# Altium schematic sheet EMMC with rk399.SchDoc
size A4; SheetNumber: 14; SheetTotal: 26
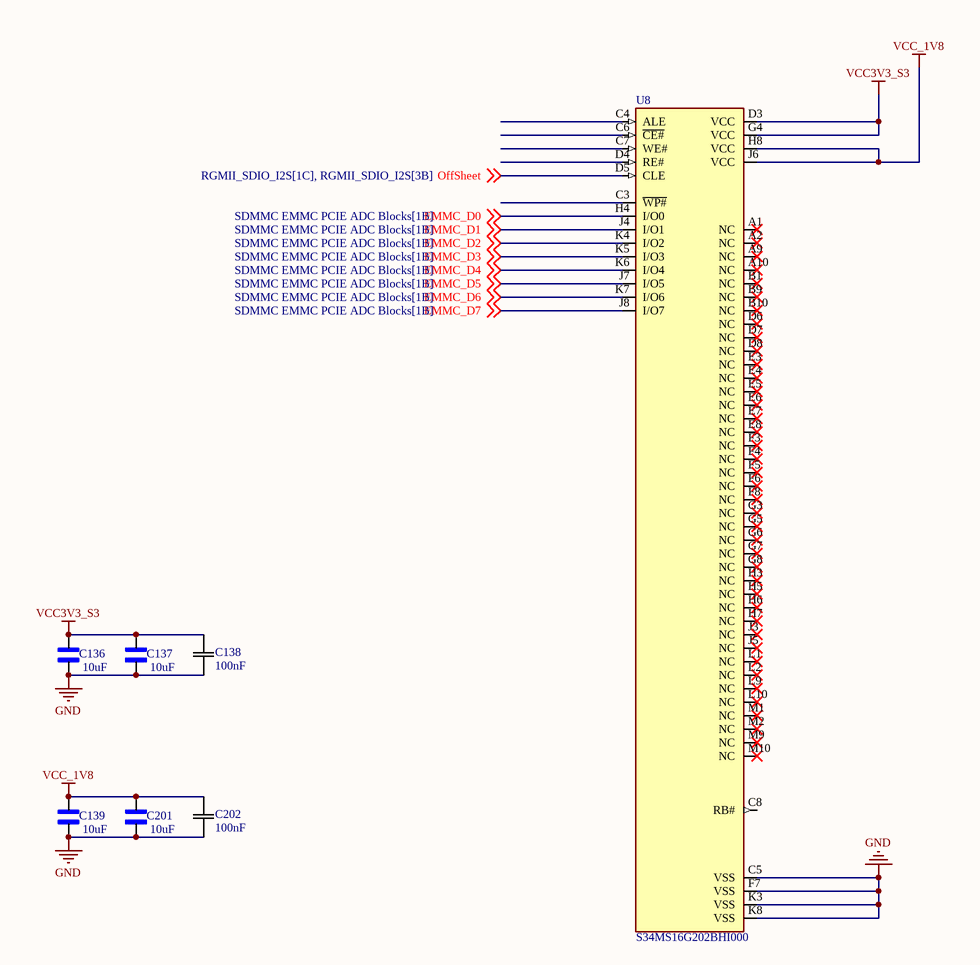
[diagram p0: EMMC with rk399.SchDoc]

## Parts
C136  10uF  [CAPC1005X70N]
C137  10uF  [CAPC1005X70N]
C138  100nF  [CAP_1005_TDK]
C139  10uF  [CAPC1005X70N]
C201  10uF  [CAPC1005X70N]
C202  100nF  [CAP_1005_TDK]
U8  S34MS16G202BHI000  [BGA63C80P12X10_1100X900X120]

## Nets
GND: C136.1 C137.1 C138.2 C139.1 C201.1 C202.2 U8.C5(VSS) U8.F7(VSS) U8.K3(VSS) U8.K8(VSS)
VCC3V3_S3: C136.2 C137.2 C138.1 U8.D3(VCC) U8.G4(VCC)
VCC_1V8: C139.2 C201.2 C202.1 U8.H8(VCC) U8.J6(VCC)
EMMC_D0: U8.H4(I/O0) ; off-sheet EMMC_D0
EMMC_D1: U8.J4(I/O1) ; off-sheet EMMC_D1
EMMC_D2: U8.K4(I/O2) ; off-sheet EMMC_D2
EMMC_D3: U8.K5(I/O3) ; off-sheet EMMC_D3
EMMC_D4: U8.K6(I/O4) ; off-sheet EMMC_D4
EMMC_D5: U8.J7(I/O5) ; off-sheet EMMC_D5
EMMC_D6: U8.K7(I/O6) ; off-sheet EMMC_D6
EMMC_D7: U8.J8(I/O7) ; off-sheet EMMC_D7
OffSheet: U8.D5(CLE) ; off-sheet OffSheet

Not connected (* = marked no-connect by the designer): U8 A1(NC)* A2(NC)* A9(NC)* A10(NC)* B1(NC)* B9(NC)* B10(NC)* C3(~{WP#}) C4(ALE) C6(~{CE#}) C7(WE#) C8(RB#) D4(RE#) D6(NC)* D7(NC)* D8(NC)* E3(NC)* E4(NC)* E5(NC)* E6(NC)* E7(NC)* E8(NC)* F3(NC)* F4(NC)* F5(NC)* F6(NC)* F8(NC)* G3(NC)* G5(NC)* G6(NC)* G7(NC)* G8(NC)* H3(NC)* H5(NC)* H6(NC)* H7(NC)* J3(NC)* J5(NC)* L1(NC)* L2(NC)* L9(NC)* L10(NC)* M1(NC)* M2(NC)* M9(NC)* M10(NC)*

## Library data of the parts
C136 C137 C139 C201 = CL05A106MQ5NUNC: 10 ÂµF Â±20% 6.3V Ceramic Capacitor X5R 0402 (1005 Metric); MF: Samsung; SnapEDA_Link: https://www.snapeda.com/parts/CL05A106MQ5NUNC/Samsung/view-part/?ref=snap; Package: SMD-2 Samsung; Value: *; MP: CL05A106MQ5NUNC; Check_prices: https://www.snapeda.com/parts/CL05A106MQ5NUNC/Samsung/view-part/?ref=eda
C138 C202 = C1005X7R1H104M050BB: Description; Manufacturer_Name: TDK; Copyright: Copyright (C) 2025 Ultra Librarian. All rights reserved.; Manufacturer_Part_Number: C1005X7R1H104M050BB
U8 = S34MS16G202BHI000: FLASH - NAND Memory IC 16Gb (4G x 4) Parallel 45 ns 63-BGA (11x9); MF: Cypress Semiconductor; SnapEDA_Link: https://www.snapeda.com/parts/S34MS16G202BHI000/Infineon/view-part/?ref=snap; Package: BGA-63 Cypress Semiconductor; Value: *; MP: S34MS16G202BHI000; Check_prices: https://www.snapeda.com/parts/S34MS16G202BHI000/Infineon/view-part/?ref=eda